# Altium schematic sheet ADE_short.SchDoc
size A
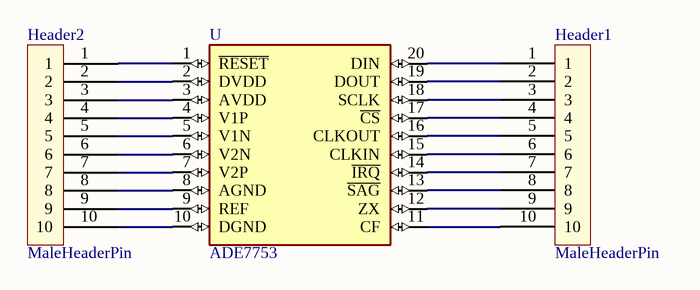
[diagram p0: ADE_short.SchDoc]

## Parts
Header1  MaleHeaderPin  [Headerx10]
Header2  MaleHeaderPin  [Headerx10]
U  ADE7753  [SSOP-20]

## Nets
NetHeader1_1: Header1.1 U.20(DIN)
NetHeader1_2: Header1.2 U.19(DOUT)
NetHeader1_3: Header1.3 U.18(SCLK)
NetHeader1_4: Header1.4 U.17(~{CS})
NetHeader1_5: Header1.5 U.16(CLKOUT)
NetHeader1_6: Header1.6 U.15(CLKIN)
NetHeader1_7: Header1.7 U.14(~{IRQ})
NetHeader1_8: Header1.8 U.13(~{SAG})
NetHeader1_9: Header1.9 U.12(ZX)
NetHeader1_10: Header1.10 U.11(CF)
NetHeader2_1: Header2.1 U.1(~{RESET})
NetHeader2_2: Header2.2 U.2(DVDD)
NetHeader2_3: Header2.3 U.3(AVDD)
NetHeader2_4: Header2.4 U.4(V1P)
NetHeader2_5: Header2.5 U.5(V1N)
NetHeader2_6: Header2.6 U.6(V2N)
NetHeader2_7: Header2.7 U.7(V2P)
NetHeader2_8: Header2.8 U.8(AGND)
NetHeader2_9: Header2.9 U.9(REF)
NetHeader2_10: Header2.10 U.10(DGND)

## Library data of the parts
U = ADE7753: IC ENERGY METERING 1PHASE 20SSOP; MF: Analog Devices; Digi-Key_Part_Number: ADE7753ARSZRLCT-ND; SnapEDA_Link: https://www.snapeda.com/parts/ADE7753/Analog%20Devices%20Inc./view-part/3209960/?ref=snap; Package: SSOP-20 Analog Devices; Value: *; MP: ADE7753